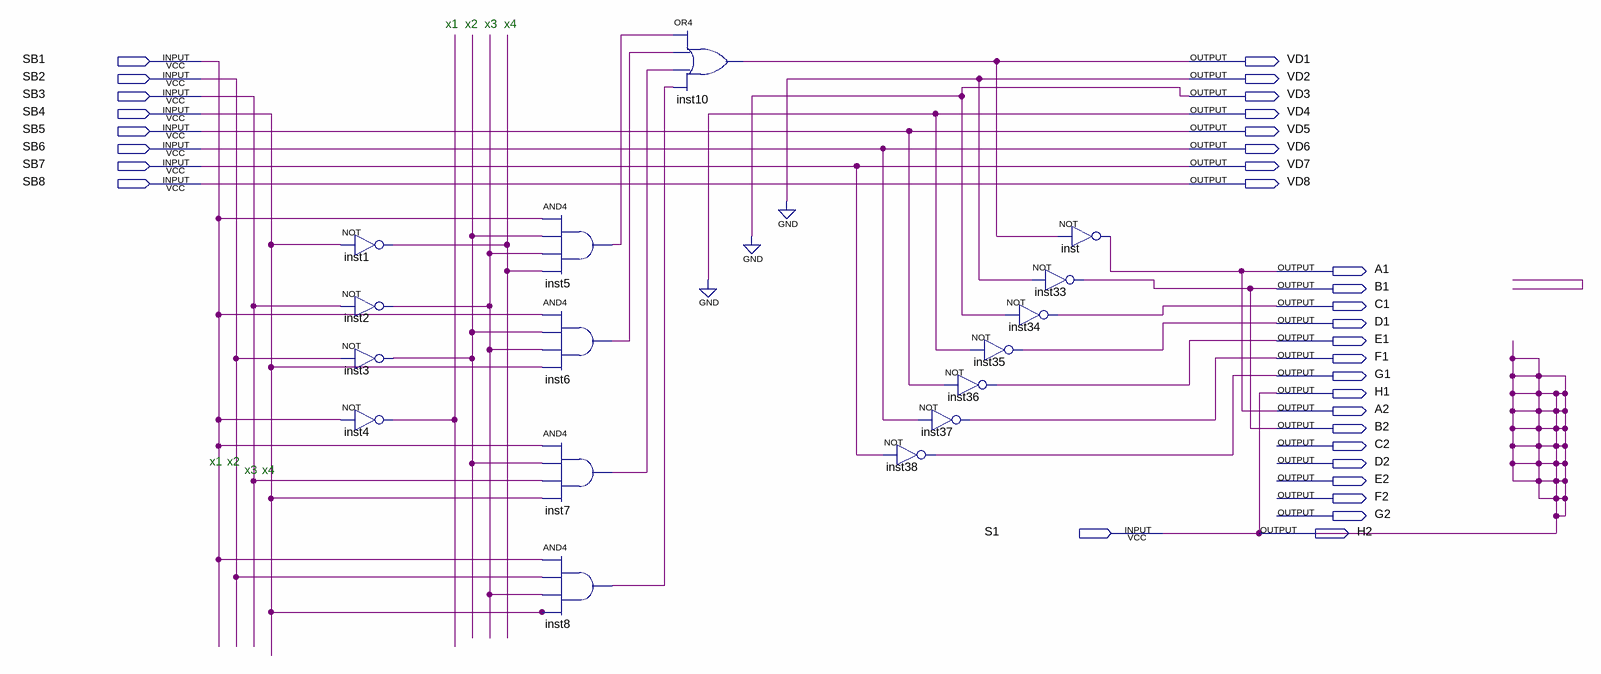
[diagram p0: schematic sheet]
// Quartus schematic project2a.bdf as structural Verilog: 16 symbols, 33 pins
module project2a (
  input  SB1,
  input  SB2,
  input  SB3,
  input  SB4,
  input  SB5,
  input  SB6,
  input  SB7,
  input  SB8,
  input  S1,
  output VD1,
  output VD2,
  output VD3,
  output VD4,
  output VD5,
  output VD6,
  output VD7,
  output VD8,
  output A1,
  output B1,
  output C1,
  output D1,
  output E1,
  output F1,
  output G1,
  output H1,
  output A2,
  output B2,
  output C2,
  output D2,
  output E2,
  output F2,
  output G2,
  output H2
);

  wire inst1_out, inst2_out, inst3_out, inst4_out, inst5_out, inst6_out, inst7_out, inst8_out;

  not inst1 (inst1_out, SB4);
  not inst2 (inst2_out, SB3);
  not inst3 (inst3_out, SB2);
  not inst4 (inst4_out, SB1);
  and inst5 (inst5_out, SB1, inst3_out, inst2_out, inst1_out);
  and inst6 (inst6_out, SB1, inst3_out, inst2_out, SB4);
  and inst7 (inst7_out, SB1, inst3_out, SB3, SB4);
  and inst8 (inst8_out, SB1, SB2, inst2_out, SB4);
  or inst10 (VD1, inst5_out, inst6_out, inst7_out, inst8_out);
  not inst37 (F1, SB6);
  not inst38 (G1, SB7);
  not inst34 (C1, 1'b0);
  not inst35 (D1, 1'b0);
  not inst36 (E1, SB5);
  not inst (A1, VD1);
  not inst33 (B1, 1'b0);

  assign A2 = A1;
  assign B2 = B1;
  assign H1 = S1;
  assign H2 = S1;
  assign VD2 = 1'b0;
  assign VD3 = 1'b0;
  assign VD4 = 1'b0;
  assign VD5 = SB5;
  assign VD6 = SB6;
  assign VD7 = SB7;
  assign VD8 = SB8;

  // Notes on the sheet:
  //   x1  x2  x3  x4
  //   x1
  //   x2
  //   x3
  //   x4
endmodule
